# EAGLE design MIDI_Breakout (EAGLE 7.2.0)
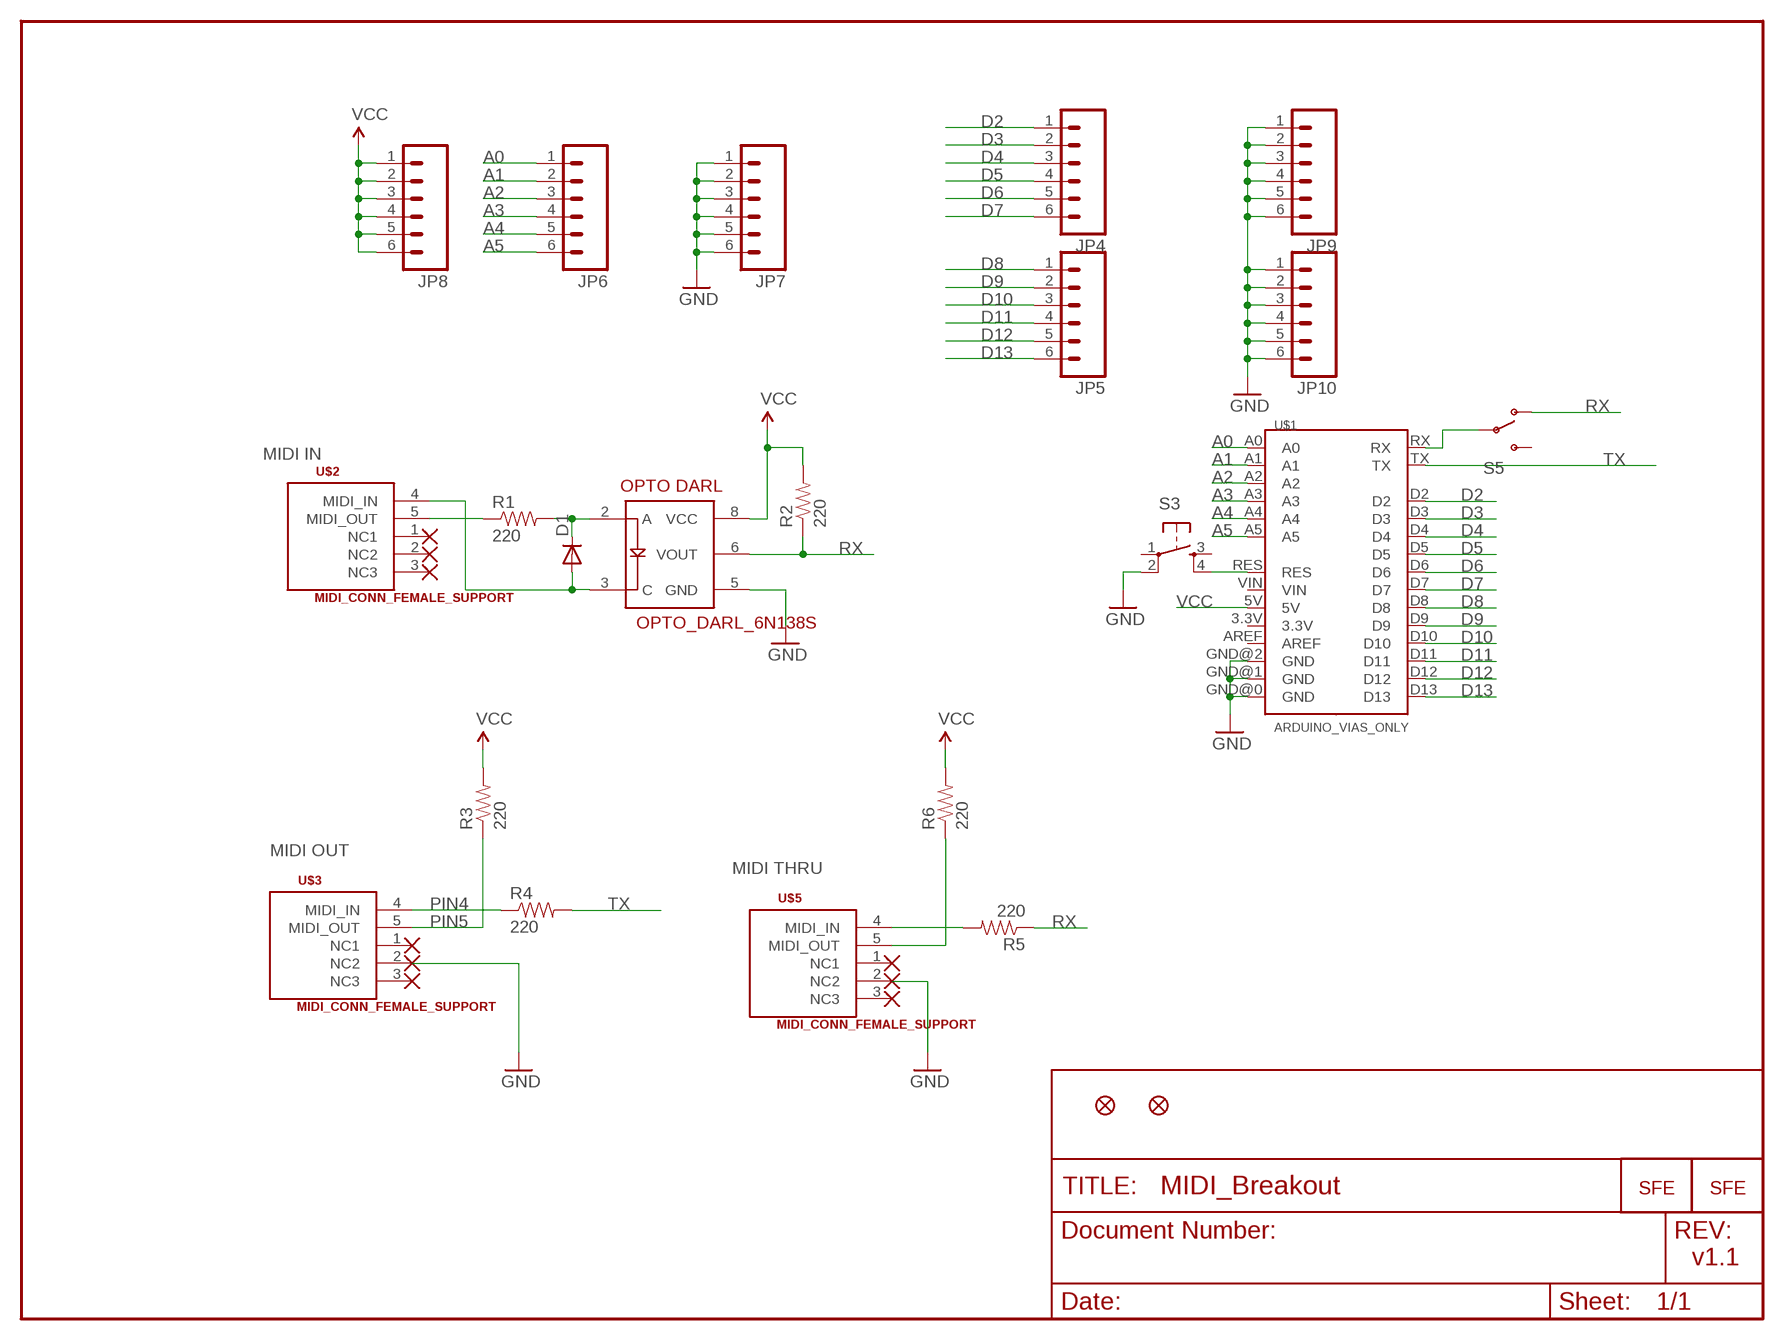
[diagram p0: schematic, sheet 1]

## Parts
D1  DIODESMA  [SMA-DIODE]
JP1  FIDUCIAL1X2  [FIDUCIAL-1X2]
JP2  FIDUCIAL1X2  [FIDUCIAL-1X2]
JP3  LOGO-SFENEW  [SFE-NEW-WEBLOGO]
JP4  M06SIP  [1X06]
JP5  M06SIP  [1X06]
JP6  M06SIP  [1X06]
JP7  M06SIP  [1X06]
JP8  M06SIP  [1X06]
JP9  M06SIP  [1X06]
JP10  M06SIP  [1X06]
JP11  LOGO-SFENEW  [SFE-NEW-WEBLOGO]
R1  220  RESISTOR0402-RES  [0402-RES]
R2  220  RESISTOR0402-RES  [0402-RES]
R3  220  RESISTOR0402-RES  [0402-RES]
R4  220  RESISTOR0402-RES  [0402-RES]
R5  220  RESISTOR0402-RES  [0402-RES]
R6  220  RESISTOR0402-RES  [0402-RES]
S3  TAC_SWITCHSMD  [TACTILE_SWITCH_SMD]
S5  SWITCH-SPSTSMD  [AYZ0202]
U$1  ARDUINO_VIAS_ONLY  [DUEMILANOVE_VIAS]
U$2  MIDI_CONN_FEMALE_SUPPORT  [DIN_5_FEMALE_SUPPORT]
U$3  MIDI_CONN_FEMALE_SUPPORT  [DIN_5_FEMALE_SUPPORT]
U$5  MIDI_CONN_FEMALE_SUPPORT  [DIN_5_FEMALE_SUPPORT]
U$6  OPTO_DARL_6N138S  [8-SMD]

## Nets
56: D1.C R1.2 U$6.2(A)
1235: R3.1 U$3.5(MIDI_OUT)
A0: JP6.1 U$1.A0
A1: JP6.2 U$1.A1
A2: JP6.3 U$1.A2
A3: JP6.4 U$1.A3
A4: JP6.5 U$1.A4
A5: JP6.6 U$1.A5
D2: JP4.1 U$1.D2
D3: JP4.2 U$1.D3
D4: JP4.3 U$1.D4
D5: JP4.4 U$1.D5
D6: JP4.5 U$1.D6
D7: JP4.6 U$1.D7
D8: JP5.1 U$1.D8
D9: JP5.2 U$1.D9
D10: JP5.3 U$1.D10
D11: JP5.4 U$1.D11
D12: JP5.5 U$1.D12
D13: JP5.6 U$1.D13
GND: JP7.1 JP7.2 JP7.3 JP7.4 JP7.5 JP7.6 JP9.1 JP9.2 JP9.3 JP9.4 JP9.5 JP9.6 JP10.1 JP10.2 JP10.3 JP10.4 JP10.5 JP10.6 S3.2 U$1.GND@0(GND) U$1.GND@1(GND) U$1.GND@2(GND) U$3.2(NC2) U$5.2(NC2) U$6.5(GND)
N$1: R6.1 U$5.5(MIDI_OUT)
N$2: R5.2 U$5.4(MIDI_IN)
N$3: R1.1 U$2.5(MIDI_OUT)
N$4: S5.2(P) U$1.RX
N$5: S3.4 U$1.RES
N$8: R4.1 U$3.4(MIDI_IN)
PIN5: D1.A U$2.4(MIDI_IN) U$6.3(C)
RX: R2.1 R5.1 S5.1(O) U$6.6(VOUT)
TX: R4.2 U$1.TX
VCC: JP8.1 JP8.2 JP8.3 JP8.4 JP8.5 JP8.6 R2.2 R3.2 R6.2 U$1.5V U$6.8(VCC)
Unconnected: S3.1 S3.3 S5.3(S) U$1.3.3V U$1.AREF U$1.VIN U$2.1(NC1) U$2.2(NC2) U$2.3(NC3) U$3.1(NC1) U$3.3(NC3) U$5.1(NC1) U$5.3(NC3)

## Notes on the sheet
- MIDI IN
- MIDI OUT
- MIDI THRU
- PIN4
- PIN5
- v1.1

## Library data of the parts
D1 = SparkFun:DIODE: Diode These are standard reverse protection diodes and small signal diodes. SMA package can handle up to about 1A. SOD-323 can handle about 200mA. What the SOD-323 package when ordering, there are some mfgs out there that are 5-pin packages.
JP1 JP2 = SparkFun:FIDUCIAL: Fiducial Alignment Points Various fiducial points for machine vision alignment.
JP3 JP11 = SparkFun:LOGO-SFE: Spark Fun Electronics PCB Logo This is the standard Spark Fun Electronics PCB logo.
JP4-JP10 = SparkFun:M06: Header 6 Standard 6-pin 0.1" header. Use with straight break away headers (SKU : PRT-00116), right angle break away headers (PRT-00553), swiss pins (PRT-00743), machine pins (PRT-00117), and female headers (PRT-00115). Molex polarized connector foot print use with SKU : PRT-08094 with associated crimp pins and housings. NOTES ON THE VARIANTS LOCK and LOCK_LONGPADS... This footprint was designed to help hold the alignment of a through-hole component (i.e. 6-pin header) while soldering it into place. You may notice that each hole has been shifted either up or down by 0.005 of an inch from it's more standard position (which is a perfectly straight line). This slight alteration caused the pins (the squares in the middle) to touch the edges of the holes. Because they are alternating, it causes a "brace" to hold the component in place. 0.005 has proven to be the perfect amount of "off-center" position when using our standard breakaway headers. Although looks a little odd when you look at the bare footprint, once you have a header in there, the alteration is very hard to notice. Also, if you push a header all the way into place, it is covered up entirely on the bottom side. This idea of altering the position of holes to aid alignment will be further integrated into the Sparkfun Library for other footprints. It can help hold any component with 3 or more connection pins.
R1-R6 = SparkFun:RESISTOR: Resistor Basic schematic elements and footprints for 0603, 1206, and PTH 1/10th watt (small) resistors.
S3 = SparkFun:TAC_SWITCH: Momentary Switch Button commonly used for reset or general input. Spark Fun Electronics SKU : COM-00097
S5 = SparkFun:SWITCH-SPST: SPST Switch Simple slide switch. Spark Fun Electronics SKU : COM-00102
U$1 = SparkFun:ARDUINO_VIAS_ONLY
U$2 U$3 U$5 = SparkFun:MIDI_CONN_FEMALE_SUPPORT
U$6 = SparkFun:OPTO_DARL_6N138S

## Board
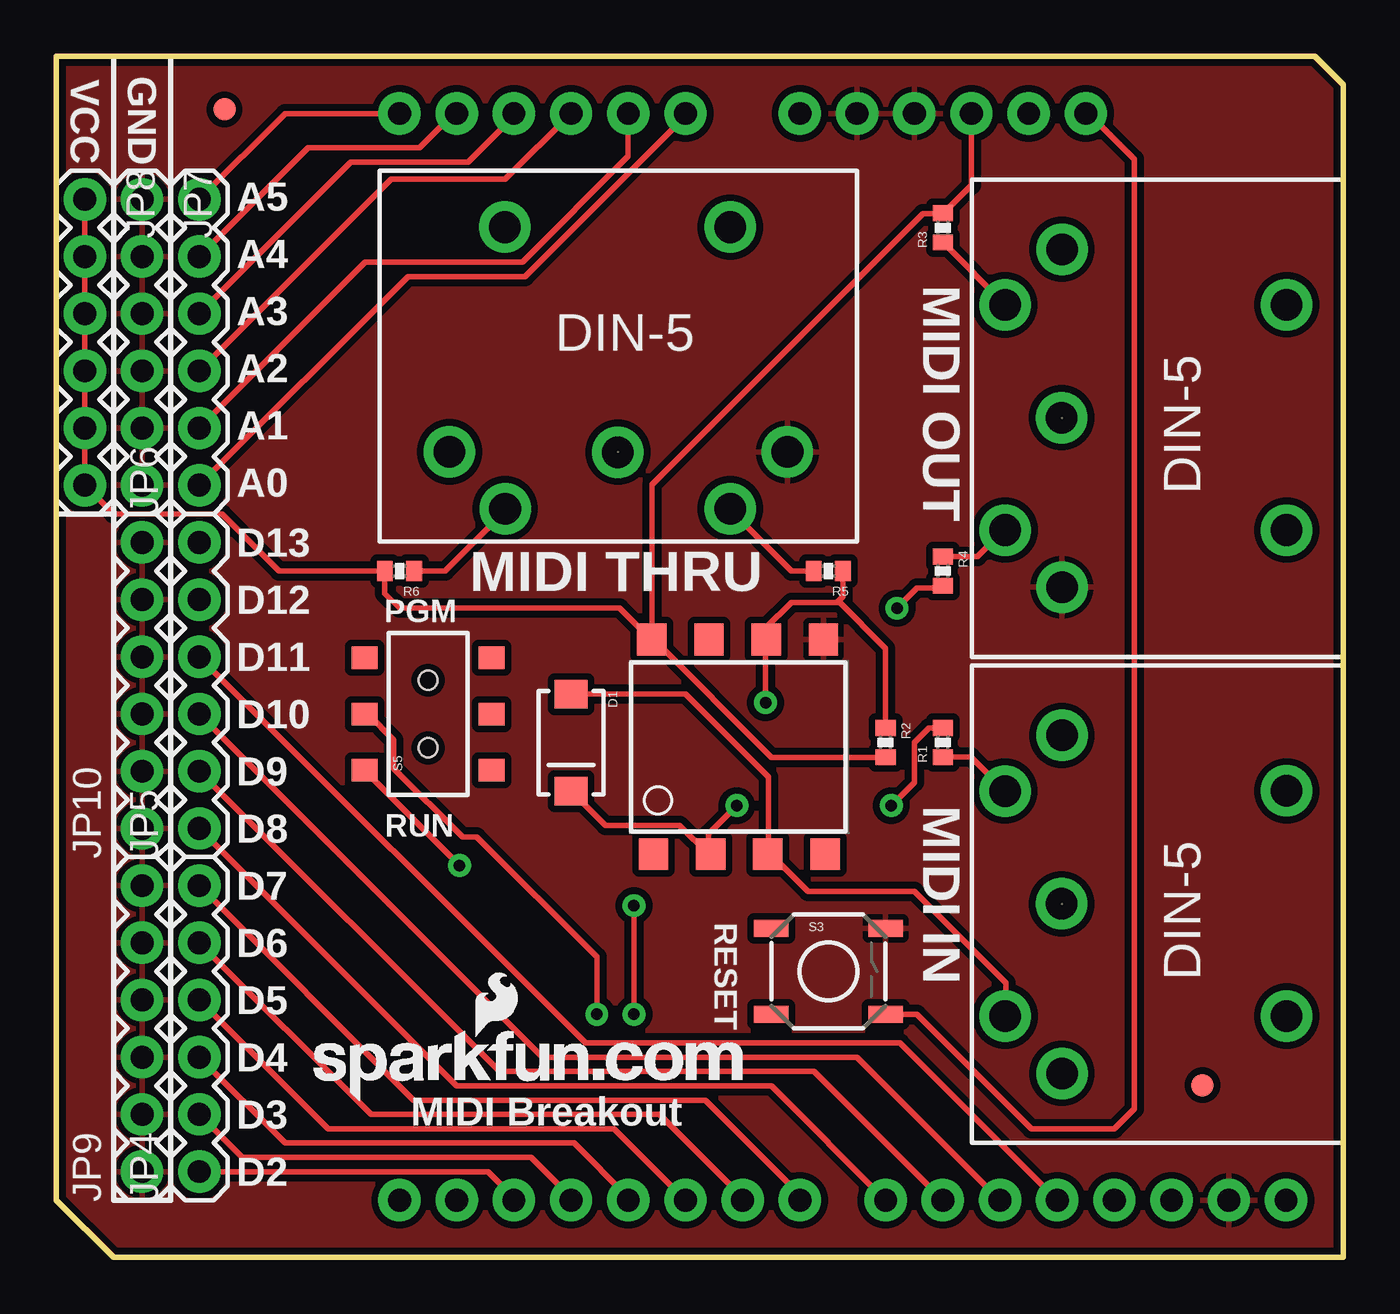
[diagram p1: board, top side]
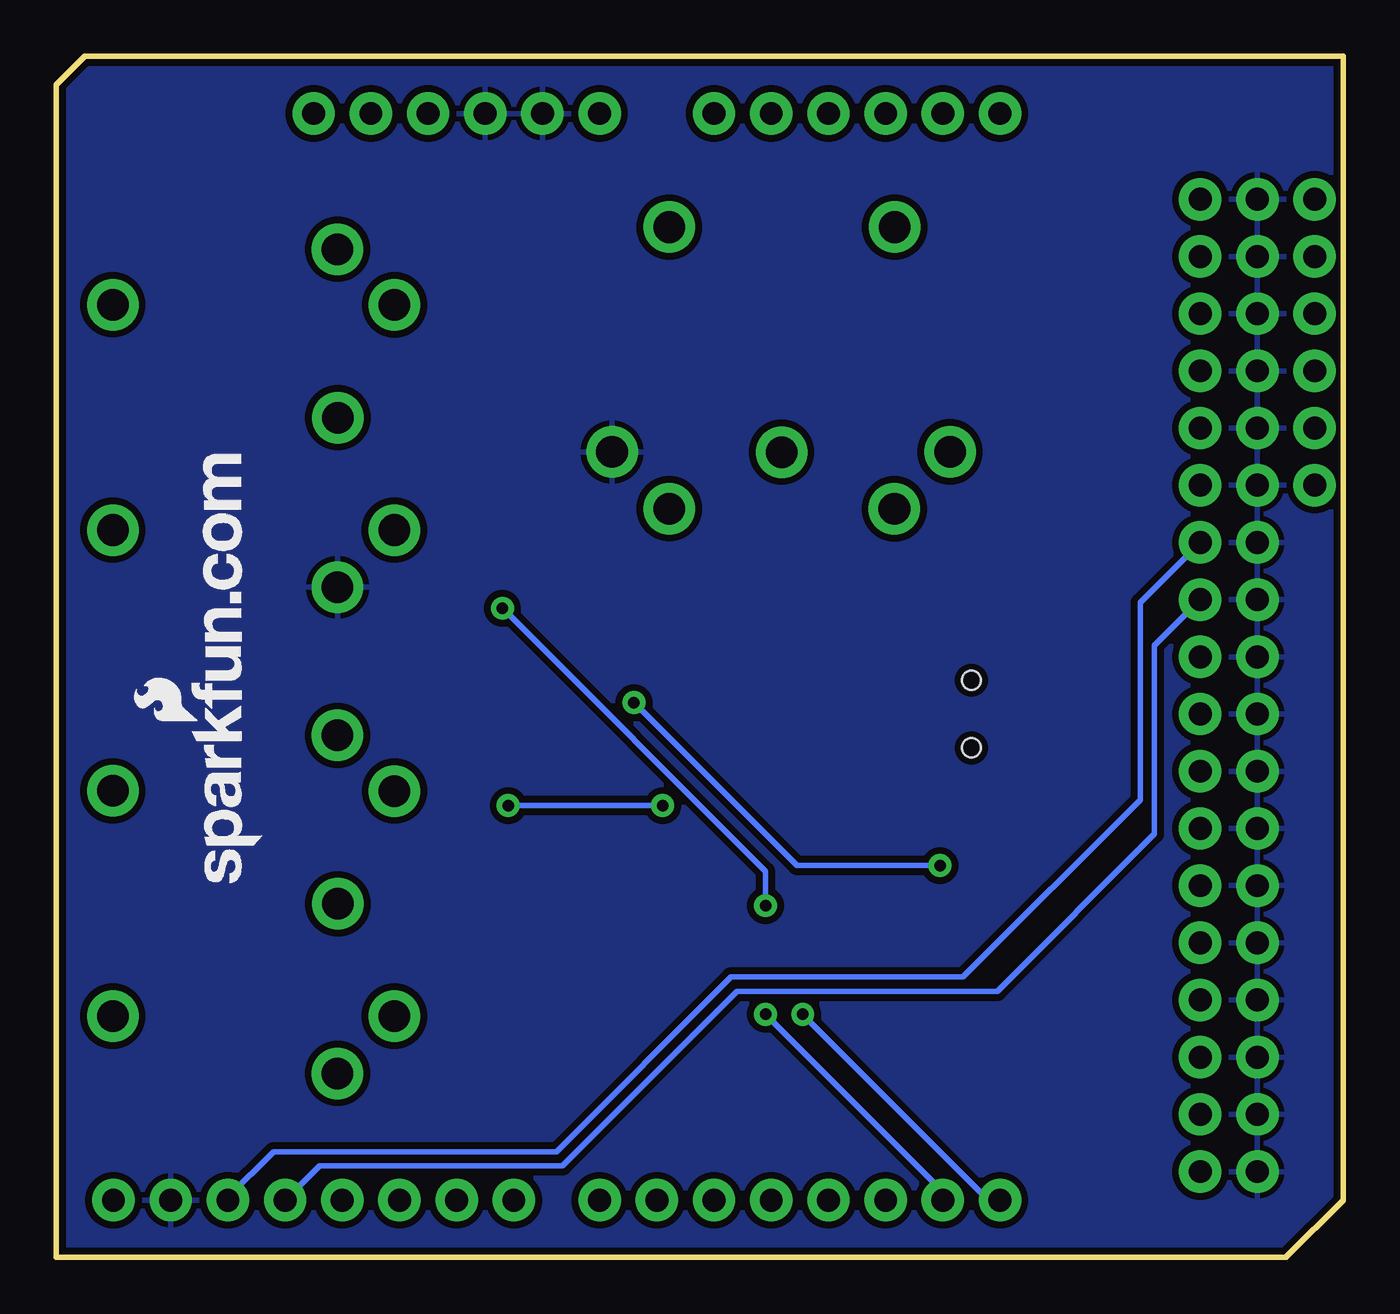
[diagram p2: board, bottom side, seen from below]

Size 57.15 x 53.34 mm. Coordinates in mm from the lower left corner, seen from the top.
Outline: 0,2.54 0,53.34 55.88,53.34 57.15,52.07 57.15,0 2.54,0 0,2.54
Copper layers (1*16): Top 0.035mm / dielectric 1.5mm / Bottom 0.035mm
Design rules "SparkFun *": minimum track width 8mil, minimum drill 20mil, track to track 8mil, track to pad 8mil, pad to pad 8mil, via to via 8mil, smd to smd 8mil, copper to edge 8mil, drill to drill 8mil, minimum pad ring 12mil, minimum via ring 10mil, stop-mask expansion 4mil, vias tented up to drill 20mil, thermal gap 10mil

### Footprints (pad centres in the part's own frame; a part is rotated, then mirrored left to right if it is on the bottom)
SMA-DIODE = smd 1.27 x 1.47: A -2.15,0; C 2.15,0
FIDUCIAL-1X2 = smd 1 x 1: 1 0,0
1X06 = drill 1.016 pad 1.88 round: 1 0,0; 2 2.54,0; 3 5.08,0; 4 7.62,0; 5 10.16,0; 6 12.7,0
0402-RES = smd 0.7 x 0.9: 1 -0.65,0; 2 0.65,0
TACTILE_SWITCH_SMD = smd 1.524 x 0.762: 1 -2.54,1.905; 2 2.54,1.905; 3 -2.54,-1.905; 4 2.54,-1.905
AYZ0202 = smd 1 x 1.15: 1 -2.5,2.825; 2 0,2.825; 3 2.5,2.825; 4 -2.5,-2.825; 5 0,-2.825; 6 2.5,-2.825 | hole 0.85: 1.5,0; -1.5,0
DUEMILANOVE_VIAS@1 = drill 1.016 pad 1.88 round: 3.3V 50.8,13.97; 5V 50.8,16.51; A0 50.8,29.21; A1 50.8,31.75; A2 50.8,34.29; A3 50.8,36.83; A4 50.8,39.37; A5 50.8,41.91; AREF 2.54,2.54; D2 2.54,36.83; D3 2.54,34.29; D4 2.54,31.75; D5 2.54,29.21; D6 2.54,26.67; D7 2.54,24.13; D8 2.54,20.32; D9 2.54,17.78; D10 2.54,15.24; D11 2.54,12.7; D12 2.54,10.16; D13 2.54,7.62; GND@0 50.8,19.05; GND@1 50.8,21.59; GND@2 2.54,5.08; RES 50.8,11.43; RX 2.54,41.91; TX 2.54,39.37; VIN 50.8,24.13
DIN_5_FEMALE_SUPPORT = drill 1.4 pad 2.286 round: 1 0.46,3.61; 2 -7.07,3.6; 3 7.94,3.6; 4 -4.53,6.12; 5 5.47,6.13; 6 -4.53,-6.382; 7 5.478,-6.382
8-SMD = smd 1.3 x 1.4: 1 -3.96,-4.96; 2 -1.42,-4.96; 3 1.12,-4.96; 4 3.66,-4.96; 5 3.59,4.58; 6 1.05,4.58; 7 -1.49,4.58; 8 -4.03,4.58

### Placement (x,y rotation side)
D1  22.86,22.86 270 top
JP1  50.9,7.65 0 top
JP2  7.47,50.98 180 top
JP3  48.01,16.64 90 bottom
JP4  6.35,3.81 90 top
JP5  6.35,19.05 90 top
JP6  6.35,34.29 90 top
JP7  3.81,46.99 270 top
JP8  1.27,46.99 270 top
JP9  3.81,3.81 90 top
JP10  3.81,19.05 90 top
JP11  11.41,6.94 0 top
R1  39.37,22.86 90 top
R2  36.83,22.86 270 top
R3  39.37,45.72 90 top
R4  39.37,30.48 270 top
R5  34.29,30.48 180 top
R6  15.24,30.48 180 top
S3  34.29,12.7 0 top
S5  16.51,24.13 90 top
U$1  ARDUINO_VIAS_ONLY  [DUEMILANOVE_VIAS@1]  57.15,0 90 top
U$2  48.26,15.24 90 top
U$3  48.26,36.83 90 top
U$5  25.4,39.37 180 top
U$6  30.48,22.86 0 top

### Tracks (layer width: path | path; a pad name or v marks a point on that pad's centre or on a via)
56  (via drill 0.51)
  Top 0.254: D1.C 24.39,19.18 27.69,19.18 28.96,17.91 | U$6.2 29.34,17.91 | U$6.2 28.96,17.91 | 28.96,17.91 U$6.2 | R1.2 38.75,23.51 38.1,22.86 38.1,21.08 v37.08,20.07 | v30.23,20.07 28.96,18.8 28.96,17.91
  Bottom 0.254: v30.23,20.07 v37.08,20.07
1235
  Top 0.254: 42.16,42.3 42.16,42.29 | U$3.5 42.16,42.3 | R3.1 39.38,45.07 42.16,42.3
A0
  Top 0.254: JP6.1 15.62,43.56 20.83,43.56 27.94,50.67 U$1.A0
A1
  Top 0.254: JP6.2 13.72,44.2 20.7,44.2 25.4,48.9 U$1.A1
A2
  Top 0.254: JP6.3 14.86,47.88 19.94,47.88 U$1.A2
A3
  Top 0.254: JP6.4 13.08,48.64 18.29,48.64 20.32,50.67 U$1.A3
A4
  Top 0.254: JP6.5 11.18,49.28 16.13,49.28 17.65,50.8 U$1.A4
A5
  Top 0.254: JP6.6 10.16,50.8 U$1.A5
D2
  Top 0.254: U$1.D2 20.45,2.54 19.18,3.81 JP4.1
D3
  Top 0.254: JP4.2 8.26,4.45 21.08,4.45 22.86,2.67 U$1.D3
D4
  Top 0.254: JP4.3 10.16,5.08 22.99,5.08 25.4,2.67 U$1.D4
D5
  Top 0.254: JP4.4 12.06,5.71 24.77,5.71 U$1.D5
D6
  Top 0.254: JP4.5 13.97,6.35 26.8,6.35 30.48,2.67 U$1.D6
D7
  Top 0.254: JP4.6 15.88,6.99 28.83,6.99 33.15,2.67 U$1.D7
D8
  Top 0.254: JP5.1 17.78,7.62 31.75,7.62 U$1.D8
D9
  Top 0.254: JP5.2 19.68,8.26 33.66,8.26 U$1.D9
D10
  Top 0.254: JP5.3 21.59,8.89 35.56,8.89 U$1.D10
D11
  Top 0.254: JP5.4 23.5,9.53 37.47,9.53 U$1.D11
D12
  Bottom 0.254: JP5.5 8.38,27.18 8.38,18.8 15.37,11.81 26.92,11.81 34.67,4.06 45.47,4.06 U$1.D12
D13
  Bottom 0.254: JP5.6 9.02,29.08 9.02,20.32 16.89,12.45 27.18,12.45 34.92,4.7 47.5,4.7 49.53,2.67 U$1.D13
GND
  pour Bottom (isolate 0.305): 0,2.54 0,53.34 57.15,53.34 57.15,0 2.54,0
  pour Top (isolate 0.305): 0,0 0,53.34 57.15,53.34 57.15,0
N$1
  Top 0.254: U$5.5 19.93,33.16 19.94,33.15 17.27,30.48 R6.1
N$2
  Top 0.254: 29.87,33.25 29.84,33.27 | U$5.4 29.87,33.25 | R5.2 32.64,30.48 29.87,33.25
N$3
  Top 0.254: R1.1 39.38,22.23 40.62,22.23 U$2.5
N$4  (via drill 0.51)
  Top 0.254: v24,10.79 24,13.34 18.67,18.67 18.03,18.67 14.99,21.72 14.99,22.99 13.84,24.13 S5.2
  Bottom 0.254: U$1.RX 15.75,2.54 v24,10.79
N$5
  Top 0.254: S3.4 38.23,10.79 43.31,5.71 46.99,5.71 47.88,6.6 47.88,48.77 45.85,50.8 U$1.RES
N$8
  Top 0.254: U$3.4 42.08,32.3 40.91,31.13 R4.1
PIN5
  Top 0.254: D1.A 27.95,25.01 31.62,21.34 31.62,18.03 31.75,17.91 31.74,17.9 | 31.74,17.9 U$6.3 | 31.74,17.9 33.39,16.26 38.1,16.26 42.16,12.19 42.16,10.73 U$2.4
RX  (via drill 0.51)
  Top 0.254: R5.1 34.94,29.35 34.73,29.15 | 34.73,29.15 34.67,29.08 32.64,29.08 31.5,27.94 31.53,27.91 U$6.6 31.53,27.14 31.62,27.05 31.5,26.92 v31.5,24.64 | R2.1 36.83,27.05 34.73,29.15 | S5.1 v17.91,17.41 v17.91,17.4
  Bottom 0.254: v17.91,17.4 24.26,17.4 v31.5,24.64
TX  (via drill 0.51)
  Top 0.254: v25.65,10.79 v25.65,15.62 | R4.2 39.26,29.72 38.23,29.72 v37.34,28.83
  Bottom 0.254: U$1.TX 17.78,2.92 v25.65,10.79 | v25.65,15.62 25.65,17.14 v37.34,28.83
VCC
  Top 0.254: U$1.5V 40.64,47.62 39.38,46.37 R3.2 39.37,46.23 39.24,46.35 38.48,46.35 26.45,34.32 U$6.8 | U$6.8 26.41,27.44 25.02,28.83 15.24,28.83 14.59,29.48 R6.2 9.91,30.48 7.37,33.02 2.54,33.02 JP8.6 JP8.5 JP8.4 JP8.3 JP8.2 JP8.1 | U$6.8 26.54,27.44 31.77,22.21 R2.2

### Text on the board
tPlace: VCC | GND | A5 | A4 | MIDI OUT | A3 | A2 | A1 | A0 | D13 | MIDI THRU | D12 | PGM | D11 | D10 | D9 | RUN | MIDI IN | D8 | D7 | RESET | D6 | D5 | D4 | MIDI Breakout | D3 | D2